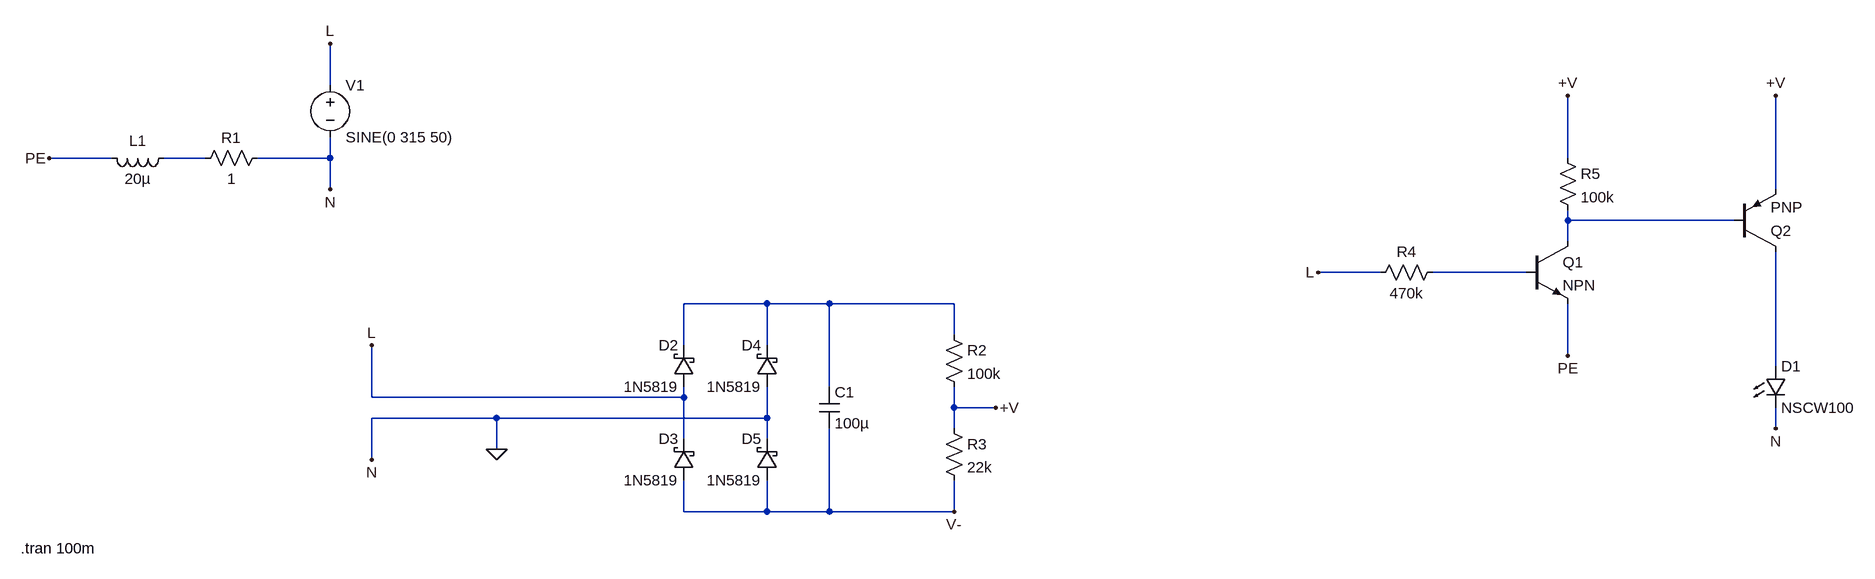
[diagram p0: schematic Draft2.asc]
Draft2.asc, the LTspice schematic file:
Version 4
SHEET 1 2432 800
WIRE 80 64 80 0
WIRE -256 176 -352 176
WIRE -112 176 -176 176
WIRE 80 176 80 144
WIRE 80 176 -32 176
WIRE 1984 176 1984 80
WIRE 80 224 80 176
WIRE 2304 224 2304 80
WIRE 1984 272 1984 256
WIRE 2240 272 1984 272
WIRE 1984 304 1984 272
WIRE 1696 352 1600 352
WIRE 1920 352 1776 352
WIRE 752 400 624 400
WIRE 848 400 752 400
WIRE 1040 400 848 400
WIRE 1040 448 1040 400
WIRE 624 464 624 400
WIRE 752 464 752 400
WIRE 1984 480 1984 400
WIRE 2304 496 2304 320
WIRE 848 528 848 400
WIRE 144 544 144 464
WIRE 624 544 624 528
WIRE 624 544 144 544
WIRE 1040 560 1040 528
WIRE 1104 560 1040 560
WIRE 336 576 144 576
WIRE 752 576 752 528
WIRE 752 576 336 576
WIRE 1040 592 1040 560
WIRE 2304 592 2304 560
WIRE 624 608 624 544
WIRE 752 608 752 576
WIRE 336 624 336 576
WIRE 144 640 144 576
WIRE 624 720 624 672
WIRE 752 720 752 672
WIRE 752 720 624 720
WIRE 848 720 848 592
WIRE 848 720 752 720
WIRE 1040 720 1040 672
WIRE 1040 720 848 720
FLAG 80 0 L
FLAG 80 224 N
FLAG -352 176 PE
FLAG 144 464 L
FLAG 144 640 N
FLAG 1600 352 L
FLAG 1984 480 PE
FLAG 1984 80 +V
FLAG 1104 560 +V
FLAG 2304 80 +V
FLAG 2304 592 N
FLAG 336 624 0
FLAG 1040 720 V-
SYMBOL voltage 80 48 R0
WINDOW 123 0 0 Left 0
WINDOW 39 0 0 Left 0
SYMATTR InstName V1
SYMATTR Value SINE(0 315 50)
SYMBOL res -16 160 R90
WINDOW 0 0 56 VBottom 2
WINDOW 3 32 56 VTop 2
SYMATTR InstName R1
SYMATTR Value 1
SYMBOL ind -160 160 R90
WINDOW 0 5 56 VBottom 2
WINDOW 3 32 56 VTop 2
SYMATTR InstName L1
SYMATTR Value 20µ
SYMBOL res 1792 336 R90
WINDOW 0 0 56 VBottom 2
WINDOW 3 32 56 VTop 2
SYMATTR InstName R4
SYMATTR Value 470k
SYMBOL npn 1920 304 R0
SYMATTR InstName Q1
SYMBOL res 1968 160 R0
SYMATTR InstName R5
SYMATTR Value 100k
SYMBOL schottky 640 528 R180
WINDOW 0 24 64 Left 2
WINDOW 3 24 0 Left 2
SYMATTR InstName D2
SYMATTR Value 1N5819
SYMATTR Description Diode
SYMATTR Type diode
SYMBOL schottky 640 672 R180
WINDOW 0 24 64 Left 2
WINDOW 3 24 0 Left 2
SYMATTR InstName D3
SYMATTR Value 1N5819
SYMATTR Description Diode
SYMATTR Type diode
SYMBOL schottky 768 528 R180
WINDOW 0 24 64 Left 2
WINDOW 3 24 0 Left 2
SYMATTR InstName D4
SYMATTR Value 1N5819
SYMATTR Description Diode
SYMATTR Type diode
SYMBOL schottky 768 672 R180
WINDOW 0 24 64 Left 2
WINDOW 3 24 0 Left 2
SYMATTR InstName D5
SYMATTR Value 1N5819
SYMATTR Description Diode
SYMATTR Type diode
SYMBOL cap 832 528 R0
SYMATTR InstName C1
SYMATTR Value 100µ
SYMBOL res 1024 432 R0
SYMATTR InstName R2
SYMATTR Value 100k
SYMBOL res 1024 576 R0
SYMATTR InstName R3
SYMATTR Value 22k
SYMBOL pnp 2240 320 M180
SYMATTR InstName Q2
SYMBOL LED 2288 496 R0
SYMATTR InstName D1
SYMATTR Value NSCW100
TEXT -396 776 Left 2 !.tran 100m

The netlist it stands for:
* Draft2.asc
V1 L 0 SINE(0 315 50)
R1 0 N001 1
L1 N001 PE 20µ
R4 N003 L 470k
Q1 N002 N003 PE 0 NPN
R5 +V N002 100k
D2 L N004 1N5819
D3 V- L 1N5819
D4 0 N004 1N5819
D5 V- 0 1N5819
C1 N004 V- 100µ
R2 N004 +V 100k
R3 +V V- 22k
Q2 N005 N002 +V 0 PNP
D1 N005 0 NSCW100
.model D D
.lib standard.dio
.model NPN NPN
.model PNP PNP
.lib standard.bjt
.tran 100m
.backanno
.end